# EAGLE design ZC_det (EAGLE 6.4)
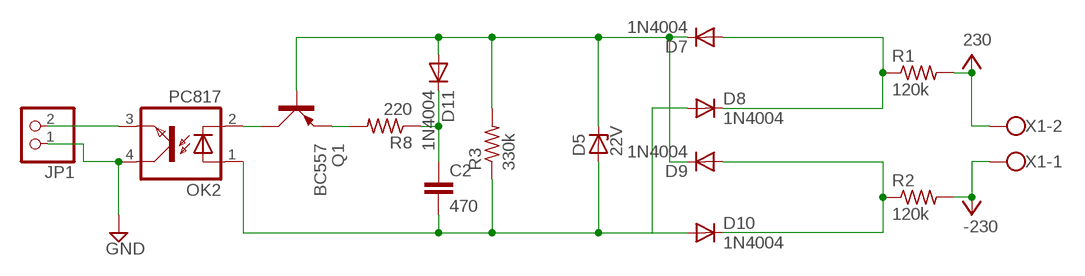
[diagram p0: schematic, sheet 1]

## Parts
C2  470  C-EU025_050-025X075  [C025_050-025X075]
D5  22V  ZENER-DIODEZD-7.5  [ZDIO-7.5]
D7  1N4004  [DO41-10]
D8  1N4004  [DO41-10]
D9  1N4004  [DO41-10]
D10  1N4004  [DO41-10]
D11  1N4004  [DO41-10]
JP1  PINHD-1X2  [1X02]
OK2  PC817  [DIL04]
Q1  BC557  [SOT54A]
R1  120k  R-US_0207/7  [0207/7]
R2  120k  R-US_0207/7  [0207/7]
R3  330k  R-US_0207/7  [0207/7]
R8  220  R-US_0207/7  [0207/7]
X1  W237-102  [W237-102]

## Nets
GND: JP1.1 OK2.4(COL)
N$1: JP1.2 OK2.3(EMIT)
N$2: Q1.E R8.2
N$3: C2.1 D11.C R8.1
N$4: OK2.2(C) Q1.C
N$6: D7.A D8.C R1.1
N$8: D9.A D10.C R2.1
N$9: D5.C D7.C D9.C D11.A Q1.B R3.2
N$10: C2.2 D5.A D8.A D10.A OK2.1(A) R3.1
V+: R1.2 X1.2 ; supply symbol labelled 230
V-: R2.2 X1.1 ; supply symbol labelled -230

## Library data of the parts
C2 = resistor:C-EU: CAPACITOR, European symbol
D5 = diode:ZENER-DIODE: Z-Diode
D7-D11 = diode:1N4004: DIODE general purpose rectifier, 1 A
JP1 = pinhead:PINHD-1X2: PIN HEADER
OK2 = optocoupler:PC817: SHARP OPTO COUPLER; MPN: PC817X4J000F; OC_FARNELL: 9707727; OC_NEWARK: 97K7059
Q1 = transistor-small-signal:BC557: PNP TRANSISTOR
R1-R3 R8 = resistor:R-US_: RESISTOR, American symbol
X1 = con-wago-500:W237-102: WAGO SCREW CLAMP; MPN: 237-102; OC_FARNELL: unknown; OC_NEWARK: 70K9898

## Board
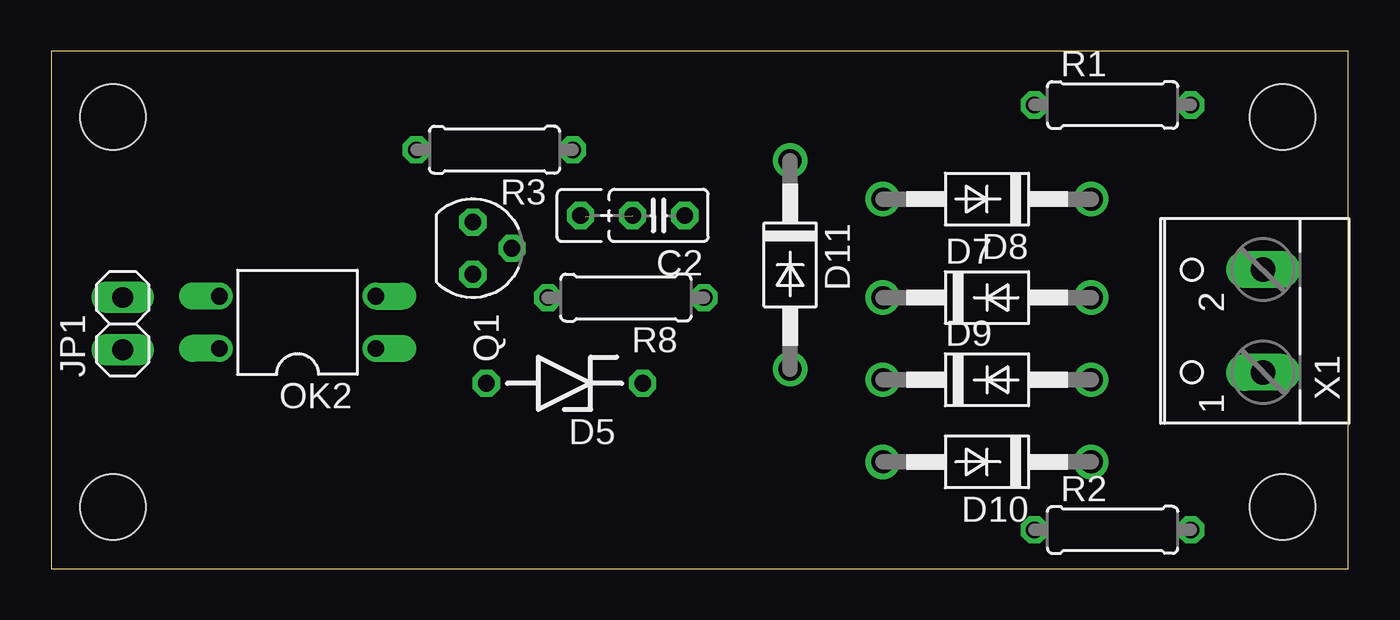
[diagram p1: board, top side]
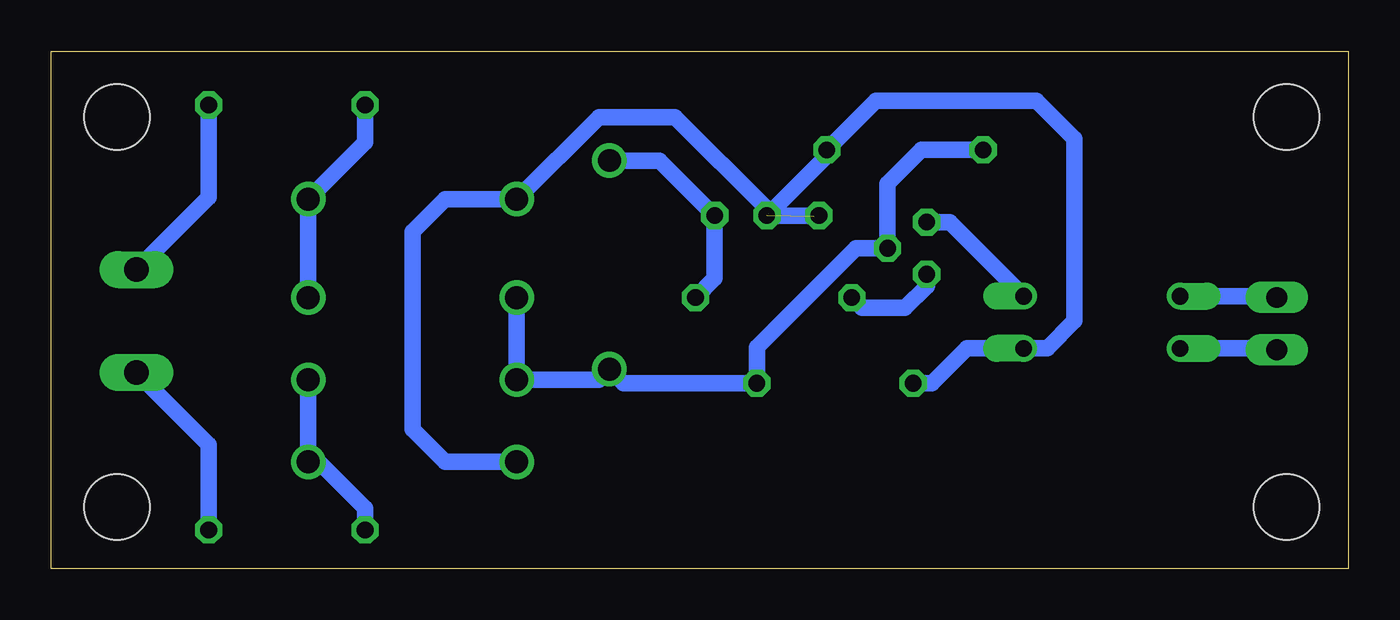
[diagram p2: board, bottom side, seen from below]

Size 63.2 x 25.2 mm. Coordinates in mm from the lower left corner, seen from the top.
Outline: 0,0 63.2,0 63.2,25.2 0,25.2 0,0
Copper layers (1*16): Top 0.035mm / dielectric 1.5mm / Bottom 0.035mm
Design rules "default": minimum track width 10mil, minimum drill 24mil, track to track 8mil, track to pad 8mil, pad to pad 8mil, via to via 8mil, smd to smd 8mil, copper to edge 40mil, drill to drill 8mil, minimum pad ring 10mil, minimum via ring 8mil, stop-mask expansion 4mil, vias tented up to drill 0mil, thermal gap 10mil
Holes 3.2 mm at 3,3 60,3 3,22 60,22

### Footprints (pad centres in the part's own frame; a part is rotated, then mirrored left to right if it is on the bottom)
C025_050-025X075 = drill 0.813 octagon: 1 -1.27,0; 2 1.27,0; 3 3.81,0
ZDIO-7.5 = drill 0.813 octagon: A 3.81,0; C -3.81,0
DO41-10 = drill 1.118: A 5.08,0; C -5.08,0
1X02 = drill 1.016 long: 1 -1.27,0; 2 1.27,0
DIL04 = drill 0.813 offset: 1 -1.27,-3.81; 2 1.27,-3.81; 3 1.27,3.81; 4 -1.27,3.81
SOT54A = drill 0.813 octagon: B 0,1.905; C -1.27,0; E 1.27,0
0207/7 = drill 0.813 octagon: 1 -3.81,0; 2 3.81,0
W237-102 = drill 1.194 long: 1 -2.5,-1.27; 2 2.5,-1.27

### Placement (x,y rotation side)
C2  29.6,17.2 180 top
D5  25.01,9.03 180 top
D7  45.6,13.2 0 top
D8  45.6,18 180 top
D9  45.6,9.2 0 top
D10  45.6,5.2 180 top
D11  36,14.8 270 top
JP1  3.48,11.94 90 top
OK2  12,12 90 top
Q1  20.54,15.61 270 top
R1  51.72,22.59 0 top
R2  51.72,1.89 0 top
R3  21.6,20.4 180 top
R8  28,13.2 180 top
X1  57.78,12.06 90 top

### Tracks (layer width: path | path; a pad name or v marks a point on that pad's centre or on a via)
GND
  Bottom 0.813: OK2.4 3.54,10.73 JP1.1
N$1
  Bottom 0.813: OK2.3 3.54,13.27 JP1.2
N$2
  Bottom 0.813: Q1.E 20.54,13.75 21.59,12.7 23.69,12.7 R8.2
N$3
  Bottom 0.813: D11.C 33.55,19.88 C2.1 30.87,14.14 R8.1
N$4
  Bottom 0.813: OK2.2 19.42,16.88 Q1.C
N$6
  Bottom 0.813: D7.A D8.C 47.91,20.77 R1.1
N$8
  Bottom 0.813: D9.A 50.68,5.71 | 50.68,5.71 D10.C | R2.1 47.91,2.94 50.68,5.71
N$9
  Bottom 0.813: D7.C D9.C 36.52,9.2 D11.A 35.31,9.03 D5.C 28.82,10.78 24,15.6 Q1.B 22.45,18.75 20.8,20.4 R3.2
N$10  (1 unrouted)
  Bottom 0.813: D10.A 44,5.2 45.6,6.8 45.6,16.4 44,18 D8.A 36.52,22 32.8,22 28.33,17.53 C2.2 | C2.2 25.41,20.12 R3.1 23.01,22.8 15.2,22.8 13.34,20.93 13.34,12.06 14.67,10.73 OK2.1 18.58,10.73 20.28,9.03 D5.A | C2.2 26.09,17.2 26.04,17.14
V+
  Bottom 0.813: R1.2 55.53,18.09 X1.2
V-
  Bottom 0.813: R2.2 55.53,6.04 X1.1